# EAGLE board amyboard-v1.5 (EAGLE 6.1), part 1 of 2
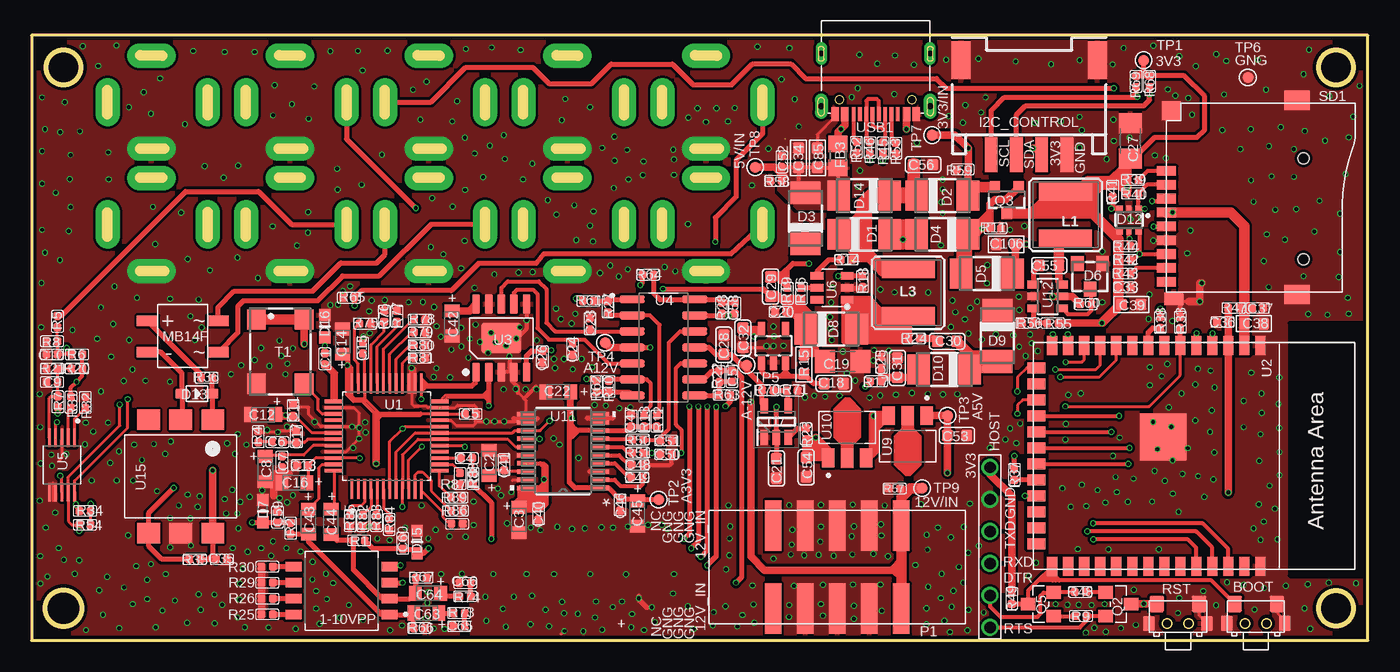
[diagram p2: board, top side]
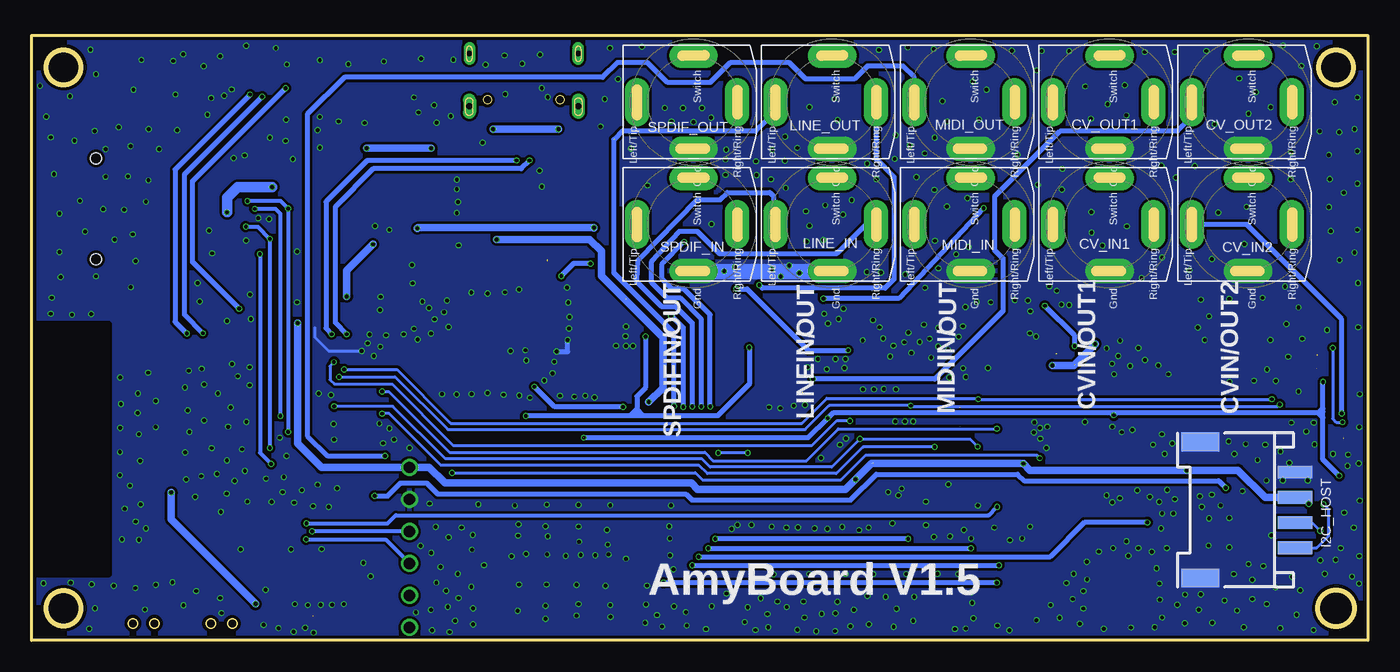
[diagram p3: board, bottom side, seen from below]

Size 106 x 48 mm. Coordinates in mm from the lower left corner, seen from the top.
Outline: 0,0 106,0 106,48 0,48 0,0
Outline: circle at 2.54,45.47 radius 1.37
Outline: circle at 2.54,2.54 radius 1.44
Outline: circle at 103.45,2.54 radius 1.37
Outline: circle at 103.45,45.47 radius 1.37
Copper layers (1*16): Top 0.035mm / dielectric 1.5mm / Bottom 0.035mm
Design rules: minimum track width 6mil, minimum drill 0.3mm, track to track 6mil, track to pad 6mil, pad to pad 6mil, via to via 6mil, smd to smd 0mil, copper to edge 10mil, drill to drill 8mil, minimum pad ring 3mil, minimum via ring 3mil, stop-mask expansion 0mil, vias tented up to drill 100mil, thermal gap 0mil
Net classes: 0 default: width 0.203 mm
tRestrict: area 99.8,5.1 to 106.2,25.1
bRestrict: area 99.8,5.2 to 106.2,25.2

## Footprints (pad centres in the part's own frame; a part is rotated, then mirrored left to right if it is on the bottom)
SW_218-4LPSTR = smd 1.27 x 0.76: 1 -3.81,1.905; 2 -3.81,0.635; 3 -3.81,-0.635; 4 -3.81,-1.905; 5 3.81,-1.905; 6 3.81,-0.635; 7 3.81,0.635; 8 3.81,1.905
2*4*3.5MM = smd 1.15 x 1.3: 1 -1.675,0; 2 1.675,0 | smd 0.9 x 1.2: 3 2.3,1.55; 4 -2.3,1.55
DISCRETE_C0402 = smd 0.635 x 0.635: 1 -0.445,0; 2 0.445,0
SMC_Z = smd 1 x 1.2: + -1,0; - 1,0
C0603 = smd 0.889 x 0.889: 1 0,0.762; 2 0,-0.762
C1206 = smd 1.6 x 1.8: 1 -1.4,0; 2 1.4,0
DISCRETE_C0603 = smd 0.889 x 0.889: 1 -0.762,0; 2 0.762,0
0603 = smd 0.889 x 0.889: 1 -0.762,0; 2 0.762,0
NV-PJ3410_SOCKET = drill 0.33 pad 1.93 long: GND 3.69,0; LEFT/TIP 0,-4.49; RIGHT/RING 0,3.459; SWITCH -3.674,0
DO-214AC = smd 1.8 x 2.4: A 2.025,0; C -2.025,0
TO236 = smd 1 x 1.2: A -1,-1; C 0,1; NC 1,-1
DIODE_PGB-0603MP = smd 0.95 x 0.9: 1 -0.889,0; 2 0.889,0
SOT363 = smd 0.5 x 0.5: 1 -0.75,-0.9; 3 0.75,-0.9; 4 0.75,0.9; 6 -0.75,0.9 | smd 0.4 x 0.5: 2 0,-0.9; 5 0,0.9
SOD323 = smd 1 x 0.8: + -1.2,0; - 1.2,0
R0805 = smd 1.3 x 1.5: 1 -0.95,0; 2 0.95,0
DEBUG*6 = drill 0.9: 1 0,0; 2 0,2.54; 3 0,5.08; 4 0,7.62; 5 0,10.16; 6 0,12.7
HW4-SMD-2.0-90D = smd 1.01 x 2.74: 1 -3,-0.1; 2 -1,-0.1; 3 1,-0.1; 4 3,-0.1 | smd 1.5 x 3: SS1 -5.4,7.4; SS2 5.4,7.4
CR54 = smd 4.2 x 1.4: P$1 0,1.85; P$2 0,-1.85
MBF = smd 1.676 x 0.813: AC1 2.8,1.2; AC2 2.8,-1.3; DCMINUS -2.8,-1.3; DCPLUS -2.8,1.2
2*5P-SMT2.54-HORN = smd 1.3 x 4: 1 -5.08,-3.3; 2 -2.54,-3.3; 3 0,-3.3; 4 2.54,-3.3; 5 5.08,-3.3; 6 5.08,3.3; 7 2.54,3.3; 8 0,3.3; 9 -2.54,3.3; 10 -5.08,3.3
PW20_TEX = smd 1.473 x 0.356: 1 -2.921,2.925; 2 -2.921,2.275; 3 -2.921,1.625; 4 -2.921,0.975; 5 -2.921,0.325; 6 -2.921,-0.325; 7 -2.921,-0.975; 8 -2.921,-1.625; 9 -2.921,-2.275; 10 -2.921,-2.925; 11 2.921,-2.925; 12 2.921,-2.275; 13 2.921,-1.625; 14 2.921,-0.975; 15 2.921,-0.325; 16 2.921,0.325; 17 2.921,0.975; 18 2.921,1.625; 19 2.921,2.275; 20 2.921,2.925
SOT23 = smd 1.016 x 1.143: 1 -0.95,-1.016; 2 0.95,-1.016; 3 0,1.016
SOT23-3 = smd 0.8 x 0.9: 1 -0.95,-1; 2 0.95,-1; 3 0,1.1
DISCRETE_R0402 = smd 0.635 x 0.635: 1 -0.445,0; 2 0.445,0
R0603 = smd 0.889 x 0.889: 1 -0.762,0; 2 0.762,0
9P-SMD-W/-RING = smd 1.524 x 0.762: 1 0,4.4; 2 0,3.3; 3 0,2.2; 4 0,1.1; 5 0,0; 6 0,-1.1; 7 0,-2.2; 8 0,-3.3; 9 0,-4.4 | smd 1.524 x 1.016: G1 0.6,-5.746 | smd 2.032 x 1.524: G2 10.373,-5.4; G3 10.373,10 | smd 1.524 x 1.524: G4 0.392,9.181 | hole 0.889: 10.9,-2.6; 10.9,5.4
SM77H = smd 1.6 x 1.5: 1 -2.55,-1.9; 2 2.55,-1.9; 3 2.55,1.9; 4 -2.55,1.9
TP_3535 = smd 0.889 x 0.889: T 0,0
QFP50P900X900X160-48N = smd 1.56 x 0.28: 1 -4.18,2.75; 2 -4.18,2.25; 3 -4.18,1.75; 4 -4.18,1.25; 5 -4.18,0.75; 6 -4.18,0.25; 7 -4.18,-0.25; 8 -4.18,-0.75; 9 -4.18,-1.25; 10 -4.18,-1.75; 11 -4.18,-2.25; 12 -4.18,-2.75; 25 4.18,-2.75; 26 4.18,-2.25; 27 4.18,-1.75; 28 4.18,-1.25; 29 4.18,-0.75; 30 4.18,-0.25; 31 4.18,0.25; 32 4.18,0.75; 33 4.18,1.25; 34 4.18,1.75; 35 4.18,2.25; 36 4.18,2.75 | smd 0.28 x 1.56: 13 -2.75,-4.18; 14 -2.25,-4.18; 15 -1.75,-4.18; 16 -1.25,-4.18; 17 -0.75,-4.18; 18 -0.25,-4.18; 19 0.25,-4.18; 20 0.75,-4.18; 21 1.25,-4.18; 22 1.75,-4.18; 23 2.25,-4.18; 24 2.75,-4.18; 37 2.75,4.18; 38 2.25,4.18; 39 1.75,4.18; 40 1.25,4.18; 41 0.75,4.18; 42 0.25,4.18; 43 -0.25,4.18; 44 -0.75,4.18; 45 -1.25,4.18; 46 -1.75,4.18; 47 -2.25,4.18; 48 -2.75,4.18
ESP32-­S2-­SOLO = smd 1.5 x 0.9: 1 -8.75,5.26; 2 -8.75,3.99; 3 -8.75,2.72; 4 -8.75,1.45; 5 -8.75,0.18; 6 -8.75,-1.09; 7 -8.75,-2.36; 8 -8.75,-3.63; 9 -8.75,-4.9; 10 -8.75,-6.17; 11 -8.75,-7.44; 12 -8.75,-8.71; 13 -8.75,-9.98; 14 -8.75,-11.25; 27 8.75,-11.25; 28 8.75,-9.98; 29 8.75,-8.71; 30 8.75,-7.44; 31 8.75,-6.17; 32 8.75,-4.9; 33 8.75,-3.63; 34 8.75,-2.36; 35 8.75,-1.09; 36 8.75,0.18; 37 8.75,1.45; 38 8.75,2.72; 39 8.75,3.99; 40 8.75,5.26 | smd 0.9 x 1.5: 15 -6.985,-12.5; 16 -5.715,-12.5; 17 -4.445,-12.5; 18 -3.175,-12.5; 19 -1.905,-12.5; 20 -0.635,-12.5; 21 0.635,-12.5; 22 1.905,-12.5; 23 3.175,-12.5; 24 4.445,-12.5; 25 5.715,-12.5; 26 6.985,-12.5 | smd 3.7 x 3.7: 41 -1.5,-2.46
ESOP-10-EP-150MIL = smd 1.5 x 0.6: 1 -2.7,2; 2 -2.7,1; 3 -2.7,0; 4 -2.7,-1; 5 -2.7,-2; 6 2.7,-2; 7 2.7,-1; 8 2.7,0; 9 2.7,1; 10 2.7,2 | smd 2.4 x 3.2: EP 0,0
SOIC127P600X175-14N = smd 1.97 x 0.6: 1 -2.475,3.81; 2 -2.475,2.54; 3 -2.475,1.27; 4 -2.475,0; 5 -2.475,-1.27; 6 -2.475,-2.54; 7 -2.475,-3.81; 8 2.475,-3.81; 9 2.475,-2.54; 10 2.475,-1.27; 11 2.475,0; 12 2.475,1.27; 13 2.475,2.54; 14 2.475,3.81
SOP50P490X110-10N = smd 1.47 x 0.28: 1 -2.15,1; 2 -2.15,0.5; 3 -2.15,0; 4 -2.15,-0.5; 5 -2.15,-1; 6 2.15,-1; 7 2.15,-0.5; 8 2.15,0; 9 2.15,0.5; 10 2.15,1
SOT-23-6 = smd 1 x 0.6: 1 -1.2,0.95; 2 -1.2,0; 3 -1.2,-0.95; 4 1.2,-0.95; 5 1.2,0; 6 1.2,0.95
SOT-25 = smd 1.2 x 0.6: 1 -1.25,0.95; 2 -1.25,0; 3 -1.25,-0.95; 4 1.25,-0.95; 5 1.25,0.95
SOT25 = smd 0.55 x 1.2: 1 -0.95,-1.3; 2 0,-1.3; 3 0.95,-1.3; 4 0.95,1.3; 5 -0.95,1.3
VREG_UA78L05ACPKG4 = smd 1.5 x 1: 1 -2,1.5; 2 -2,0; 3 -2,-1.5
SOT23-6 = smd 0.6 x 0.9: 1 -0.95,-1.15; 2 0,-1.15; 3 0.95,-1.15; 4 0.95,1.15; 5 0,1.15; 6 -0.95,1.15
SOP-6-2.54MM = smd 1.6 x 1.8: 1 -4.5,2.54; 2 -4.5,0; 3 -4.5,-2.54; 4 4.5,-2.54; 5 4.5,0; 6 4.5,2.54
TYPE-C-31-M-12 = smd 0.3 x 1.1: A5 -1.25,0.05; A6 -0.25,0.05; A7 0.25,0.05; A8 1.25,0.05; B5 1.75,0.05; B6 0.75,0.05; B7 -0.75,0.05; B8 -1.75,0.05 | smd 0.6 x 1.1: GND -3.225,0.05; GND2 3.225,0.05; VBUS1 -2.45,0.05; VBUS2 2.45,0.05 | drill 0.5 pad 1.016 long: P$1 4.32,-0.57; P$2 -4.32,-0.57 | drill 0.45 pad 0.9 long: P$3 -4.32,-4.75; P$4 4.32,-4.75

## Placement (x,y rotation side)
1-10VPP  218-4LPSTR  [SW_218-4LPSTR]  24.59,3.94 180 top
BOOT  TS24CA  [2*4*3.5MM]  97.1,2.9 180 top
C1  100nF  [DISCRETE_C0402]  23.27,22.33 90 top
C2  10uF/10V/TAN  [SMC_Z]  36.28,14.07 90 top
C3  10uF/10V/TAN  [SMC_Z]  38.66,9.55 270 top
C4  100nF  [DISCRETE_C0402]  34.52,14.45 0 top
C5  100nF  [DISCRETE_C0402]  34.82,17.96 0 top
C6  68nF  [DISCRETE_C0402]  19.51,15.72 0 top
C7  100nF  [DISCRETE_C0402]  19.86,14.15 270 top
C8  10uF/10V/TAN  [SMC_Z]  18.54,13.59 270 top
C9  1nF  [DISCRETE_C0402]  1.63,20.5 180 top
C10  1nF  [DISCRETE_C0402]  1.63,22.68 180 top
C11  100nF  [DISCRETE_C0402]  20.75,18.24 90 top
C12  10uF/10V/TAN  [SMC_Z]  18.36,17.91 180 top
C13  100nF  [DISCRETE_C0402]  21.51,13.89 180 top
C14  10uF/10V/TAN  [SMC_Z]  24.69,23.7 90 top
C15  100nF  [DISCRETE_C0402]  26.26,23.19 90 top
C16  10uF/10V/TAN  [SMC_Z]  20.85,12.5 180 top
C17  4.7nF  [DISCRETE_C0402]  21.01,16.15 270 top
C18  10uF  [C0603]  63.63,20.37 90 top
C19  22uF  [C1206]  64.34,22.12 0 top
C20  100nF  [DISCRETE_C0402]  59.41,26.06 0 top
C21  2.2uF  [C0603]  59.08,13.64 180 top
C22  10uF/10V/TAN  [SMC_Z]  41.78,19.71 180 top
C23  100nF  [DISCRETE_C0402]  44.3,25.12 270 top
C24  100nF  [DISCRETE_C0402]  42.9,23.09 90 top
C25  100nF  [DISCRETE_C0402]  67.41,22.05 90 top
C26  100nF  [DISCRETE_C0402]  40.51,22.5 90 top
C27  22uF  [C1206]  87.15,39.62 90 top
C28  2.2uF  [C0603]  54.91,23.44 180 top
C29  22pF  [C0603]  58.62,28.07 180 top
C30  1uF  [C0603]  72.62,23.72 90 top
C31  10uF  [C0603]  68.68,21.62 0 top
C32  1uF  [C0603]  56.41,24 0 top
C33  100nF  [DISCRETE_C0402]  86.74,28.02 180 top
C34  10uF  [DISCRETE_C0603]  60.83,38.28 270 top
C35  100nF  [DISCRETE_C0402]  15.09,6.43 0 top
C36  100nF  [DISCRETE_C0402]  94.46,25.25 0 top
C37  100nF  [DISCRETE_C0402]  97.26,26.37 180 top
C38  10uF  [DISCRETE_C0603]  96.95,25.12 0 top
C39  10uF  [DISCRETE_C0603]  87.22,26.64 180 top
C40  100nF  [DISCRETE_C0402]  40.21,10.03 270 top
C41  100nF  [DISCRETE_C0402]  37.49,13.94 270 top
C42  10uF/10V/TAN  [SMC_Z]  33.35,25.15 270 top
C43  10uF/10V/TAN  [SMC_Z]  21.97,9.42 270 top
C44  10uF/10V/TAN  [SMC_Z]  23.75,9.4 270 top
C45  10uF/10V/TAN  [SMC_Z]  48.06,10.06 270 top
C46  100nF  [DISCRETE_C0402]  46.69,10.74 270 top
C47  100nF  [DISCRETE_C0402]  47.55,17.4 90 top
C48  2.2uF  [DISCRETE_C0402]  48.06,13.92 180 top
C49  2.2uF  [DISCRETE_C0402]  48.03,12.93 180 top
C50  2.2nF  [DISCRETE_C0402]  50.34,14.76 180 top
C51  2.2nF  [DISCRETE_C0402]  50.34,15.85 180 top
C52  100nF  [DISCRETE_C0402]  59.51,37.97 270 top
C53  1uF  [C0603]  73.41,16.26 90 top
C54  1uF  [C0603]  61.44,13.74 0 top
C55  22nF  [C0603]  80.72,29.74 90 top
C56  10uF  [C0603]  70.71,37.74 90 top
C57  220pF  [DISCRETE_C0402]  55.55,20.93 270 top
C58  220pF  [DISCRETE_C0402]  55.78,26.37 90 top
C59  100pF  [DISCRETE_C0402]  19.51,9.78 270 top
C60  100pF  [DISCRETE_C0402]  29.44,7.7 270 top
C63  10uF/10V/TAN  [SMC_Z]  31.32,2.16 180 top
C64  10uF/10V/TAN  [SMC_Z]  31.45,3.73 180 top
C65  10nF  [DISCRETE_C0402]  33.91,1.12 0 top
C66  10nF  [DISCRETE_C0402]  34.39,4.55 0 top
C85  10uF  [DISCRETE_C0603]  62.33,38.28 270 top
C106  22uF/16V  [0603]  77.29,31.42 180 top
CV_IN1  NV-PJ3410_STEREO  [NV-PJ3410_SOCKET]  20.5,33 270 bottom
CV_IN2  NV-PJ3410_STEREO  [NV-PJ3410_SOCKET]  9.5,33 270 bottom
CV_OUT1  NV-PJ3410_STEREO  [NV-PJ3410_SOCKET]  20.5,42.7 270 bottom
CV_OUT2  NV-PJ3410_STEREO  [NV-PJ3410_SOCKET]  9.5,42.7 270 bottom
D1  SS34  [DO-214AC]  66.04,32.21 0 top
D2  SS34  [DO-214AC]  72.24,35.28 0 top
D3  SS34  [DO-214AC]  61.39,33.48 90 top
D4  SS34  [DO-214AC]  72.24,32.21 180 top
D5  SS34  [DO-214AC]  75.77,29.11 180 top
D6  BZX84C3V3  [TO236]  83.95,28.88 180 top
D7  DIODE_PGB-0603MP  [DIODE_PGB-0603MP]  18.34,10.24 270 top
D8  SS34  [DO-214AC]  63.42,24.69 0 top
D9  SS34  [DO-214AC]  76.61,24.16 270 top
D10  SS34  [DO-214AC]  72.39,21.49 180 top
D12  SMF05C  [SOT363]  87.05,33.35 180 top
D13  1N4148WS  [SOD323]  13.13,19.56 0 top
D14  SS34  [DO-214AC]  66.04,35.28 180 top
D15  DIODE_PGB-0603MP  [DIODE_PGB-0603MP]  30.58,7.8 270 top
D16  DIODE_PGB-0603MP  [DIODE_PGB-0603MP]  23.27,24.92 270 top
FB3  100Mhz@120R  [R0805]  63.96,38.43 270 top
HOST  DEBUG6  [DEBUG*6]  76.02,13.72 180 top
I2C_CONTROL  HW4-SMD-2.0  [HW4-SMD-2.0-90D]  79.12,38.63 0 top
I2C_HOST  HW4-SMD-2.0  [HW4-SMD-2.0-90D]  5.89,10.34 90 bottom
L1  10µH  [CR54]  82.02,33.76 180 top
L3  3.3µH/±30%/3.4A  [CR54]  69.55,27.58 0 top
LINE_IN  NV-PJ3410_STEREO  [NV-PJ3410_SOCKET]  42.5,33 270 bottom
LINE_OUT  NV-PJ3410_STEREO  [NV-PJ3410_SOCKET]  42.5,42.7 270 bottom
MB14F  MB14F  [MBF]  11.99,24.16 0 top
MIDI_IN  NV-PJ3410_STEREO  [NV-PJ3410_SOCKET]  31.5,33 270 bottom
MIDI_OUT  NV-PJ3410_STEREO  [NV-PJ3410_SOCKET]  31.5,42.7 270 bottom
P1  2X5P-SMT2.542  [2*5P-SMT2.54-HORN]  63.91,5.82 0 top
PCM5101  U11  [PW20_TEX]  42.16,15.01 180 top
Q2  S8050  [SOT23]  86.21,2.87 270 top
Q3  DMP4065SQ  [SOT23-3]  77.34,34.98 180 top
Q5  S8050  [SOT23]  80.06,2.87 90 top
R1  5.1K  [DISCRETE_R0402]  25.98,7.92 0 top
R2  5.1K  [DISCRETE_R0402]  20.55,8.89 90 top
R3  150R  [DISCRETE_R0402]  35.03,12.83 270 top
R4  680R  [DISCRETE_R0402]  17.98,16.15 90 top
R5  39.7K  [DISCRETE_R0402]  2.06,25.3 90 top
R6  13.1K  [DISCRETE_R0402]  3.61,22.68 0 top
R7  39.7K  [DISCRETE_R0402]  2.08,18.92 270 top
R8  10K  [DISCRETE_R0402]  1.63,23.72 0 top
R9  10K  [DISCRETE_R0402]  83.24,1.93 0 top
R10  30K  [DISCRETE_R0402]  45.8,20.14 90 top
R11  100K  [DISCRETE_R0402]  76.45,32.69 180 top
R12  10K  [DISCRETE_R0402]  49.61,17.4 270 top
R13  10K  [DISCRETE_R0402]  48.59,17.4 270 top
R14  10K  [DISCRETE_R0402]  64.64,30.2 180 top
R15  10R  [R0603]  61.26,21.89 90 top
R16  0R  [DISCRETE_R0402]  61.06,27.53 90 top
R17  10R  [DISCRETE_R0402]  66.98,20.55 0 top
R18  4.65K  [DISCRETE_R0402]  65.91,28.47 270 top
R19  100K  [DISCRETE_R0402]  59.94,27.53 90 top
R20  13.1K  [DISCRETE_R0402]  3.61,21.56 0 top
R21  10K  [DISCRETE_R0402]  1.63,21.56 0 top
R22  51K  [DISCRETE_R0402]  54.53,20.93 90 top
R23  1K  [DISCRETE_R0402]  61.44,16.38 90 top
R24  2R  [DISCRETE_R0402]  70,23.95 180 top
R25  2.2K  [DISCRETE_R0402]  18.69,2.06 0 top
R26  2.2K  [DISCRETE_R0402]  18.69,3.3 0 top
R27  30K  [DISCRETE_R0402]  45.72,26.47 270 top
R28  51K  [DISCRETE_R0402]  54.74,26.37 270 top
R29  22K  [DISCRETE_R0402]  18.69,4.57 0 top
R30  22K  [DISCRETE_R0402]  18.69,5.84 0 top
R31  10K  [DISCRETE_R0402]  3.12,18.9 270 top
R32  10K  [DISCRETE_R0402]  4.27,18.87 270 top
R33  10K  [DISCRETE_R0402]  91.11,25.22 270 top
R34  5.1K  [DISCRETE_R0402]  4.24,10.26 180 top
R35  470R  [DISCRETE_R0402]  12.95,6.43 180 top
R36  220R  [DISCRETE_R0402]  13.89,20.83 0 top
R37  22R  [DISCRETE_R0402]  77.95,13.16 270 top
R38  22R  [DISCRETE_R0402]  89.53,25.22 270 top
R39  10K  [DISCRETE_R0402]  87.35,36.53 180 top
R40  10K  [DISCRETE_R0402]  87.35,35.46 180 top
R41  10K  [DISCRETE_R0402]  85.75,35.64 90 top
R42  10K  [DISCRETE_R0402]  86.74,30.2 180 top
R43  10K  [DISCRETE_R0402]  86.74,29.11 180 top
R44  NC  [DISCRETE_R0402]  86.74,31.27 180 top
R45  51R  [DISCRETE_R0402]  67.54,39.07 270 top
R46  51R  [DISCRETE_R0402]  66.5,39.09 270 top
R47  10K  [DISCRETE_R0402]  95.35,26.37 0 top
R48  10K  [DISCRETE_R0402]  83.19,3.84 180 top
R49  10K  [DISCRETE_R0402]  77.75,3.33 90 top
R50  470R  [DISCRETE_R0402]  48.08,15.93 180 top
R51  470R  [DISCRETE_R0402]  48.08,14.88 180 top
R52  5.1K  [DISCRETE_R0402]  65.43,39.12 270 top
R53  5.1K  [DISCRETE_R0402]  68.55,39.04 270 top
R54  5.1K  [DISCRETE_R0402]  4.24,9.17 180 top
R55  100K  [DISCRETE_R0402]  81,25.17 180 top
R56  22.2K  [DISCRETE_R0402]  78.99,25.17 180 top
R57  100K  [DISCRETE_R0402]  68.45,12.04 180 top
R58  100K  [DISCRETE_R0402]  59.05,36.45 180 top
R59  100K  [DISCRETE_R0402]  73.84,37.36 180 top
R60  100K  [DISCRETE_R0402]  83.62,26.67 0 top
R61  100R  [DISCRETE_R0402]  44.17,26.92 0 top
R62  100R  [DISCRETE_R0402]  44.81,20.14 270 top
R63  100R  [DISCRETE_R0402]  54.99,19.46 180 top
R64  100R  [DISCRETE_R0402]  48.9,29.01 0 top
R65  75R  [DISCRETE_R0402]  25.17,27.18 180 top
R66  51K  [DISCRETE_R0402]  30.76,0.97 0 top
R67  51K  [DISCRETE_R0402]  30.91,4.95 0 top
R68  5.1K  [DISCRETE_R0402]  88.67,44.35 90 top
R69  5.1K  [DISCRETE_R0402]  87.6,44.35 90 top
R70  120K  [DISCRETE_R0402]  58.39,19.84 0 top
R71  13.1K  [DISCRETE_R0402]  60.33,19.81 0 top
R73  100  [DISCRETE_R0402]  33.91,2.16 180 top
R74  100  [DISCRETE_R0402]  34.39,3.48 180 top
R75  10K  [DISCRETE_R0402]  26.47,25.12 0 top
R76  10K  [DISCRETE_R0402]  27.97,25.7 90 top
R77  10K  [DISCRETE_R0402]  28.98,25.7 90 top
R78  10K  [DISCRETE_R0402]  30.78,25.45 0 top
R79  10K  [DISCRETE_R0402]  30.78,24.43 0 top
R80  10K  [DISCRETE_R0402]  30.78,23.42 0 top
R81  10K  [DISCRETE_R0402]  30.78,22.4 0 top
R82  10K  [DISCRETE_R0402]  26.29,9.5 270 top
R83  10K  [DISCRETE_R0402]  27.36,9.5 270 top
R84  10K  [DISCRETE_R0402]  28.37,9.19 270 top
R85  10K  [DISCRETE_R0402]  25.27,9.5 270 top
R86  10K  [DISCRETE_R0402]  33.76,9.25 0 top
R87  10K  [DISCRETE_R0402]  33.71,11.33 0 top
R88  10K  [DISCRETE_R0402]  33.99,12.83 270 top
R89  10K  [DISCRETE_R0402]  33.73,10.29 0 top
RST  TS24CA  [2*4*3.5MM]  90.93,2.88 180 top
SD1  SD  [9P-SMD-W/-RING]  90,32.84 0 top
SPDIF_IN  NV-PJ3410_STEREO  [NV-PJ3410_SOCKET]  53.5,33 270 bottom
SPDIF_OUT  NV-PJ3410_STEREO  [NV-PJ3410_SOCKET]  53.5,42.7 270 bottom
T1  SM77H  [SM77H]  19.74,22.91 270 top
TP1  [TP_3535]  88.19,46.02 0 top
TP2  [TP_3535]  49.73,11.15 90 top
TP3  [TP_3535]  72.64,17.83 90 top
TP4  [TP_3535]  45.49,23.6 90 top
TP5  [TP_3535]  56.72,21.84 90 top
TP6  [TP_3535]  96.47,44.65 90 top
TP7  [TP_3535]  71.42,40.08 0 top
TP8  [TP_3535]  57.4,37.54 0 top
TP9  [TP_3535]  70.64,12.06 0 top
U1  PCM9211PT  [QFP50P900X900X160-48N]  28.17,16.21 90 top
U2  ESP32­S2­SOLO  [ESP32-­S2-­SOLO]  92.2,14.63 270 top
U3  GP8413  [ESOP-10-EP-150MIL]  37.26,23.98 90 top
U4  TL074CD  [SOIC127P600X175-14N]  50.11,23.24 0 top
U5  ADS1015IDGSR  [SOP50P490X110-10N]  2.41,13.92 270 top
U6  HX3608  [SOT-23-6]  63.5,27.97 180 top
U7  SGM2209-ADJ  [SOT-25]  59.08,17.35 90 top
U8  TS5205  [SOT25]  58.85,23.37 0 top
U9  78L05-150  [VREG_UA78L05ACPKG4]  69.5,15.82 270 top
U10  78L33  [VREG_UA78L05ACPKG4]  64.7,16.48 90 top
U12  MT2492  [SOT23-6]  80.59,27.28 270 top
U15  H11L1SR2M  [SOP-6-2.54MM]  11.84,13 270 top
USB1  TYPE-C-31-M-12  [TYPE-C-31-M-12]  66.95,41.81 180 top